# EAGLE schematic base_mcu_sch (EAGLE 9.2.0)
AUTHORS: Austin Keener, Peter Wilson, Johannes Kunz, Mukund Pandiri; REVISION: 1.0; SCH_DESC: Ethernet Breakout Board for Lidar Lite 3 Modules; TEAM: RoboRacing; TITLE: Lidar_Breakout
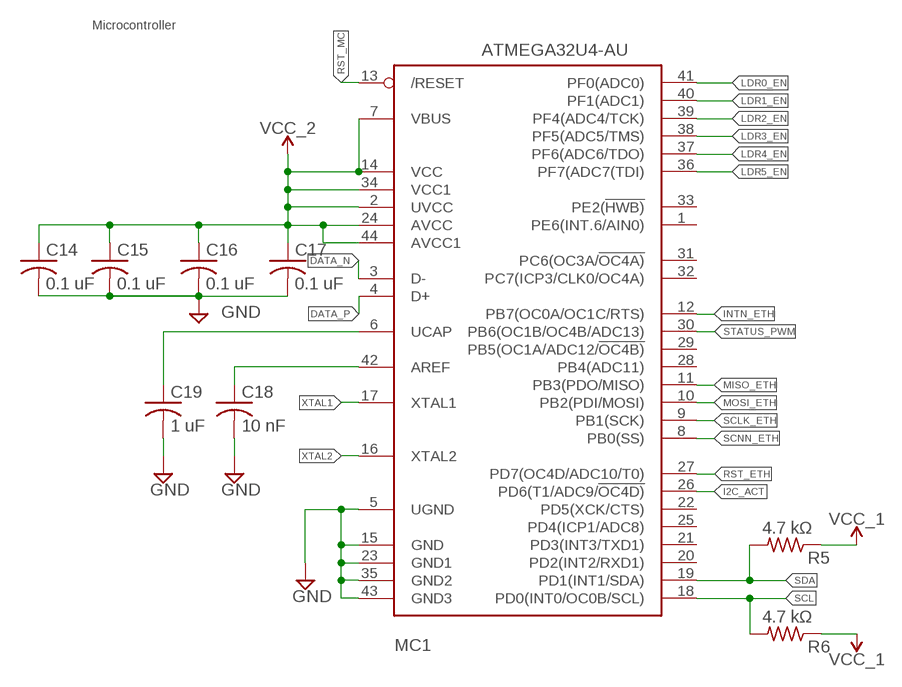
[diagram p0: schematic, sheet 1]

## Parts
C14  0.1 uF  C-USC0603  [C0603]
C15  0.1 uF  C-USC0603  [C0603]
C16  0.1 uF  C-USC0603  [C0603]
C17  0.1 uF  C-USC0603  [C0603]
C18  10 nF  C-USC0603  [C0603]
C19  1 uF  C-USC0603  [C0603]
MC1  ATMEGA32U4-AU  [TQFP44]
R5  4.7 kΩ  R-US_R0603  [R0603]
R6  4.7 kΩ  R-US_R0603  [R0603]

## Nets
AREF: C18.1 MC1.42(AREF)
DATA_N [diff]: MC1.3(D-)
DATA_P [diff]: MC1.4(D+)
GND: C14.2 C15.2 C16.2 C17.2 C18.2 C19.2 MC1.5(UGND) MC1.15(GND) MC1.23(GND1) MC1.35(GND2) MC1.43(GND3)
I2C_ACT: MC1.26(PD6(T1/ADC9/!OC4D))
INTN_ETH: MC1.12(PB7(OC0A/OC1C/RTS))
LDR0_EN: MC1.41(PF0(ADC0))
LDR1_EN: MC1.40(PF1(ADC1))
LDR2_EN: MC1.39(PF4(ADC4/TCK))
LDR3_EN: MC1.38(PF5(ADC5/TMS))
LDR4_EN: MC1.37(PF6(ADC6/TDO))
LDR5_EN: MC1.36(PF7(ADC7(TDI))
MISO_ETH: MC1.11(PB3(PDO/MISO))
MOSI_ETH: MC1.10(PB2(PDI/MOSI))
RST_ETH: MC1.27(PD7(OC4D/ADC10/T0))
RST_MC: MC1.13(/RESET)
SCL: MC1.18(PD0(INT0/OC0B/SCL)) R6.2
SCLK_ETH: MC1.9(PB1(SCK))
SCNN_ETH: MC1.8(PB0(SS))
SDA: MC1.19(PD1(INT1/SDA)) R5.2
STATUS_PWM: MC1.30(PB6(OC1B/OC4B/ADC13))
UCAP: C19.1 MC1.6(UCAP)
VCC_1: R5.1 R6.1
VCC_2: C14.1 C15.1 C16.1 C17.1 MC1.2(UVCC) MC1.7(VBUS) MC1.14(VCC) MC1.24(AVCC) MC1.34(VCC1) MC1.44(AVCC1)
XTAL1: MC1.17(XTAL1)
XTAL2: MC1.16(XTAL2)
Unconnected: MC1.1(PE6(INT.6/AIN0)) MC1.20(PD2(INT2/RXD1)) MC1.21(PD3(INT3/TXD1)) MC1.22(PD5(XCK/CTS)) MC1.25(PD4(ICP1/ADC8)) MC1.28(PB4(ADC11)) MC1.29(PB5(OC1A/ADC12/!OC4B)) MC1.31(PC6(OC3A/!OC4A)) MC1.32(PC7(ICP3/CLK0/OC4A)) MC1.33(PE2(!HWB))

## Notes on the sheet
- Microcontroller

## Library data of the parts
C14-C19 = resistor:C-US: CAPACITOR, American symbol
MC1 = adafruit:ATMEGA32U4: http://www.ladyada.net/library/eagle
R5 R6 = rcl:R-US_: RESISTOR, American symbol; SPICEPREFIX: R

## Net classes
0 default: width 0.203 mm
2 diff: width 0.406 mm